# Altium schematic sheet DCoffset.SchDoc
size A; SheetNumber: 1; SheetTotal: 2
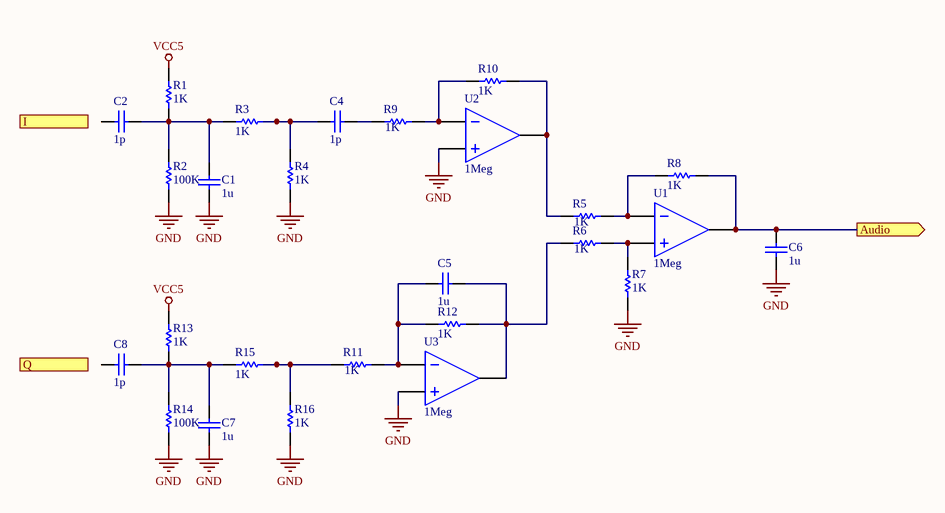
[diagram p0: DCoffset.SchDoc]

## Parts
C1  value 1u  (hidden comment: Capacitor)
C2  value 1p  (hidden comment: Capacitor)
C4  value 1p  (hidden comment: Capacitor)
C5  value 1u  (hidden comment: Capacitor)
C6  value 1u  (hidden comment: Capacitor)
C7  value 1u  (hidden comment: Capacitor)
C8  value 1p  (hidden comment: Capacitor)
R1  value 1K  (hidden comment: Resistor)
R2  value 100K  (hidden comment: Resistor)
R3  value 1K  (hidden comment: Resistor)
R4  value 1K  (hidden comment: Resistor)
R5  value 1K  (hidden comment: Resistor)
R6  value 1K  (hidden comment: Resistor)
R7  value 1K  (hidden comment: Resistor)
R8  value 1K  (hidden comment: Resistor)
R9  value 1K  (hidden comment: Resistor)
R10  value 1K  (hidden comment: Resistor)
R11  value 1K  (hidden comment: Resistor)
R12  value 1K  (hidden comment: Resistor)
R13  value 1K  (hidden comment: Resistor)
R14  value 100K  (hidden comment: Resistor)
R15  value 1K  (hidden comment: Resistor)
R16  value 1K  (hidden comment: Resistor)
U1  GAIN: 1Meg  (hidden comment: Ideal Operational Amplifier)
U2  GAIN: 1Meg  (hidden comment: Ideal Operational Amplifier)
U3  GAIN: 1Meg  (hidden comment: Ideal Operational Amplifier)

## Ports
Audio (out), I (in), Q (in)

## Nets
GND: C1.1 C6.1 C7.1 R2.1 R4.2 R7.1 R14.1 R16.2 U2.2(IN+) U3.2(IN+)
VCC5: R1.2 R13.2
Audio: C6.2 R8.1 U1.3(OUT) ; port Audio
NetC1_2: C1.2 C2.2 R1.1 R2.2 R3.2
NetC4_1: C4.1 R3.1 R4.1
NetC4_2: C4.2 R9.2
NetC5_1: C5.1 R6.2 R12.1 U3.3(OUT)
NetC5_2: C5.2 R11.1 R12.2 U3.1(IN-)
NetC7_2: C7.2 C8.2 R13.1 R14.2 R15.2
NetR5_1: R5.1 R8.2 U1.1(IN-)
NetR5_2: R5.2 R10.1 U2.3(OUT)
NetR6_1: R6.1 R7.2 U1.2(IN+)
NetR9_1: R9.1 R10.2 U2.1(IN-)
NetR11_2: R11.2 R15.1 R16.1

Not connected (* = marked no-connect by the designer): C2 1; C8 1

## Library data of the parts
C1 C2 C4-C8 = Capacitor: SimulationGenericComponent: True
R1-R16 = Resistor: TC1: 0; SimulationGenericComponent: True; TC2: 0
U1-U3 = OpAmp: SimulationGenericComponent: True